# Altium schematic sheet top_level.SchDoc: TOP LEVEL
size A2; Organization: Altium Limited; Address1: L3, 12a Rodborough Rd; Address2: Frenchs Forest; Address3: NSW; Address4: Australia 2086; DocumentNumber: 1; Revision: 1
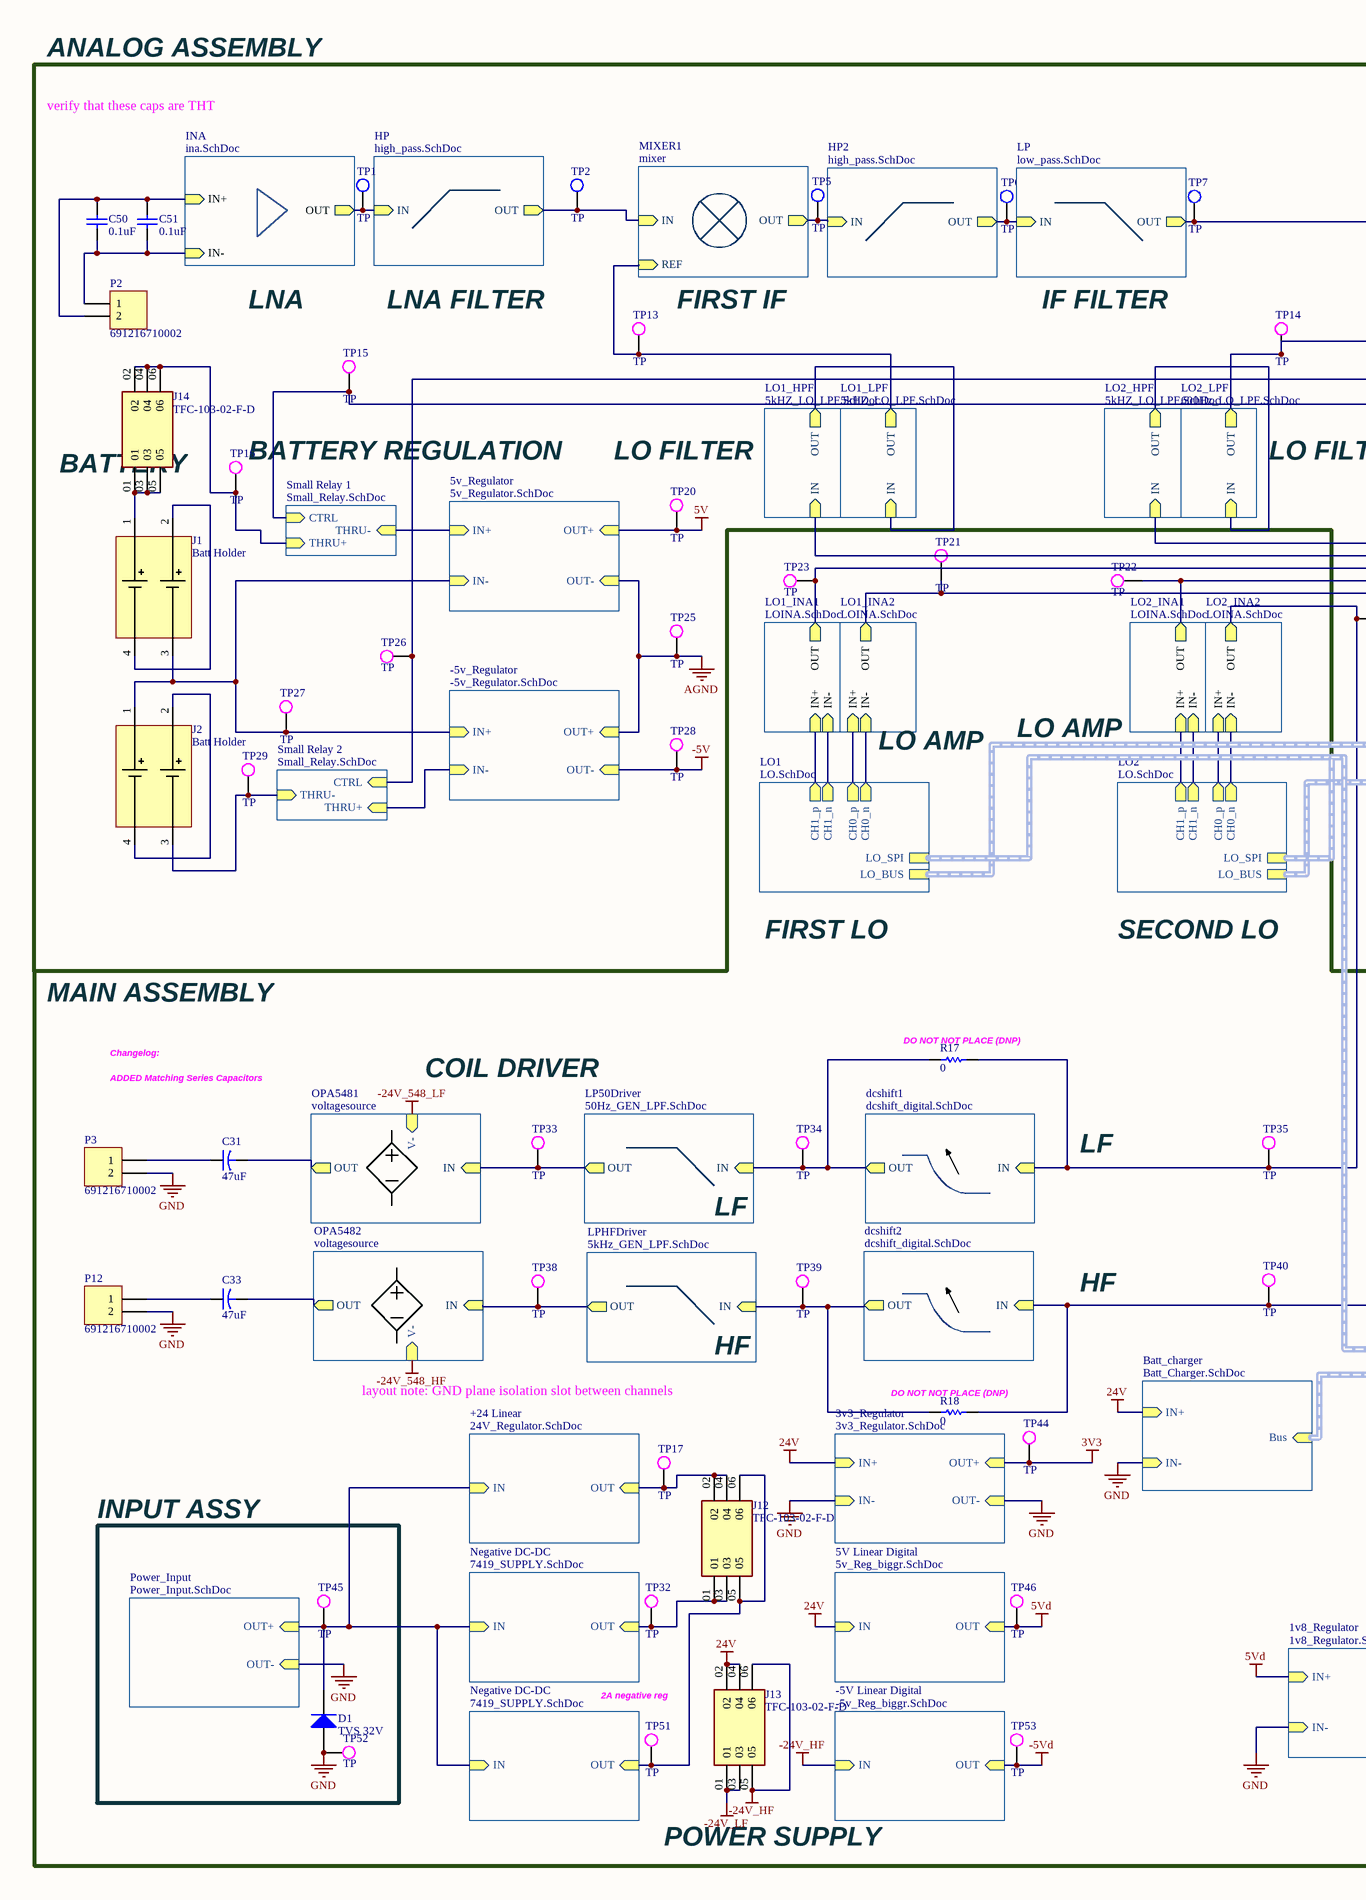
[diagram p0: top_level.SchDoc, left]
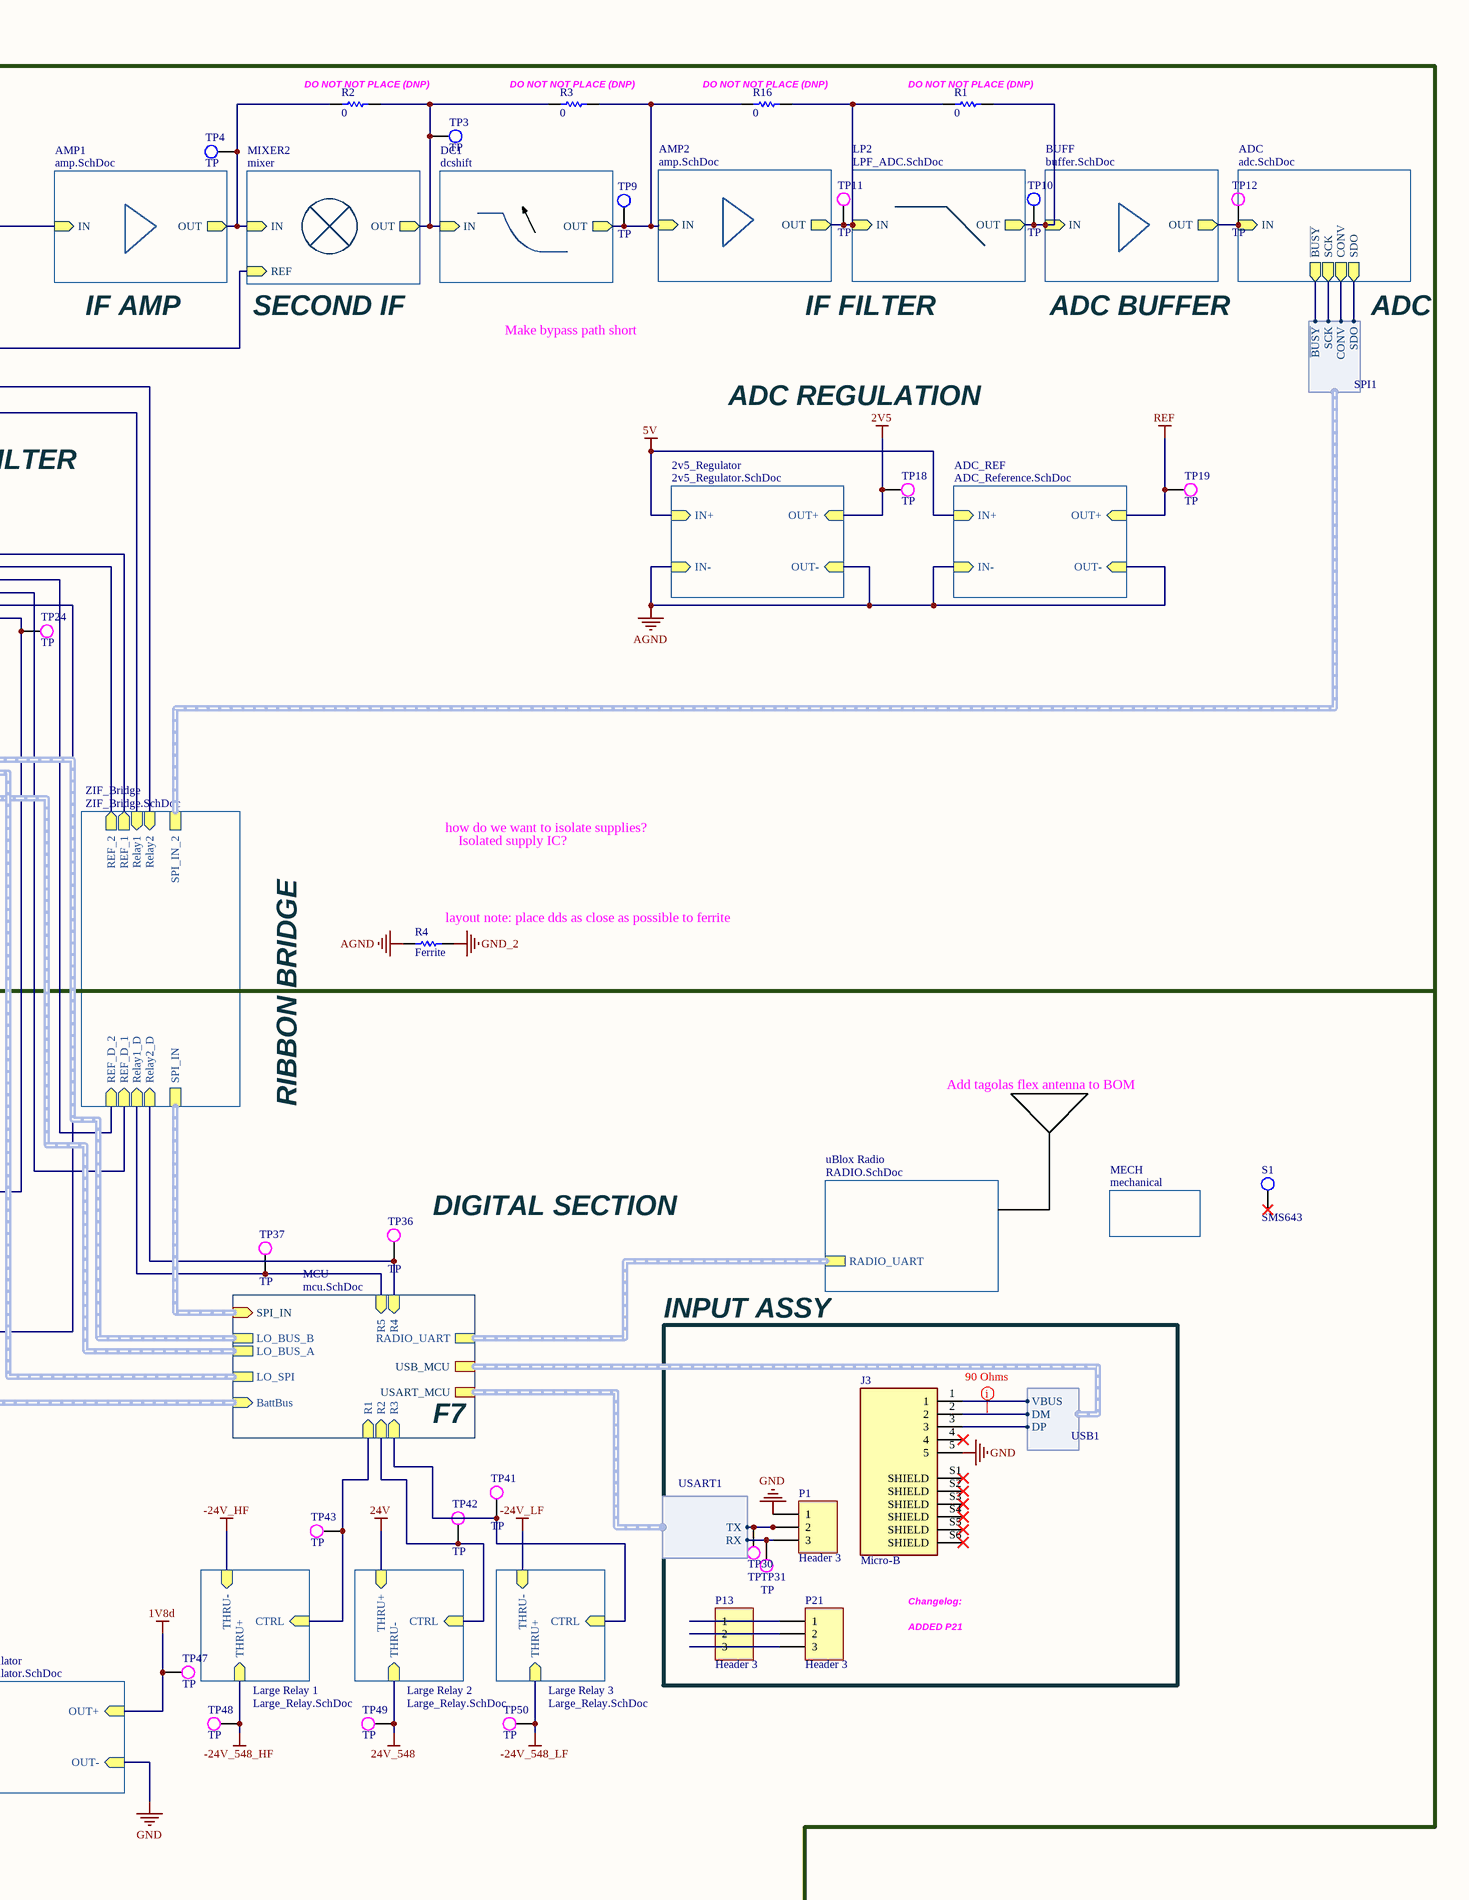
[diagram p1: top_level.SchDoc, right]

## Parts
C31  47uF  [R60xW]
C33  47uF  [10uF_THT_Ceramic]
C50  0.1uF  [STD_0805_C]
C51  0.1uF  [STD_0805_C]
D1  TVS 32V  [TVSDIODE-DO214AA]
J1  Batt Holder  [SMD_Batteryholder]
J2  Batt Holder  [SMD_Batteryholder]
J3  Micro-B  [10118194-0001LF]
J12  TFC-103-02-F-D  [SAMTEC_TFC-103-02-F-D]
J13  TFC-103-02-F-D  [SAMTEC_TFC-103-02-F-D]
J14  TFC-103-02-F-D  [SAMTEC_TFC-103-02-F-D]
P1  Header 3  [HDR1X3]
P2  691216710002  [HDR1X2]
P3  691216710002  [HDR1X2]
P12  691216710002  [HDR1X2]
P13  Header 3  [HDR1X3]
P21  Header 3  [HDR1X3]
R1  0  [0402_Res]
R2  0  [0402_Res]
R3  0  [0402_Res]
R4  Ferrite  [0402_Res]
R16  0  [0402_Res]
R17  0  [0402_Res]
R18  0  [0402_Res]
S1  SMS643  [SMS-463F]
TP1  TP  [Test_point]
TP2  TP  [Test_point]
TP3  TP  [Test_point]
TP4  TP  [Test_point]
TP5  TP  [Test_point]
TP6  TP  [Test_point]
TP7  TP  [Test_point]
TP9  TP  [Test_point]
TP10  TP  [Test_point]
TP11  TP  [Test_point]
TP12  TP  [Test_point]
TP13  TP  [Test_point]
TP14  TP  [Test_point]
TP15  TP  [Test_point]
TP16  TP  [Test_point]
TP17  TP  [Test_point]
TP18  TP  [Test_point]
TP19  TP  [Test_point]
TP20  TP  [Test_point]
TP21  TP  [Test_point]
TP22  TP  [Test_point]
TP23  TP  [Test_point]
TP24  TP  [Test_point]
TP25  TP  [Test_point]
TP26  TP  [Test_point]
TP27  TP  [Test_point]
TP28  TP  [Test_point]
TP29  TP  [Test_point]
TP30  TP  [Test_point]
TP31  TP  [Test_point]
TP32  TP  [Test_point]
TP33  TP  [Test_point]
TP34  TP  [Test_point]
TP35  TP  [Test_point]
TP36  TP  [Test_point]
TP37  TP  [Test_point]
TP38  TP  [Test_point]
TP39  TP  [Test_point]
TP40  TP  [Test_point]
TP41  TP  [Test_point]
TP42  TP  [Test_point]
TP43  TP  [Test_point]
TP44  TP  [Test_point]
TP45  TP  [Test_point]
TP46  TP  [Test_point]
TP47  TP  [Test_point]
TP48  TP  [Test_point]
TP49  TP  [Test_point]
TP50  TP  [Test_point]
TP51  TP  [Test_point]
TP52  TP  [Test_point]
TP53  TP  [Test_point]

## Blocks framed on the sheet
INPUT ASSY: J3 P1 P13 P21 TP30 TP31
INPUT ASSY: D1 TP45 TP52

## Sub-sheets
1v8_Regulator = 1v8_Regulator.SchDoc: IN+ (in), IN- (in), OUT+ (in), OUT- (in)
2v5_Regulator = 2v5_Regulator.SchDoc: IN+ (in), IN- (in), OUT+ (in), OUT- (in)
3v3_Regulator = 3v3_Regulator.SchDoc: IN+ (in), IN- (in), OUT+ (in), OUT- (in)
5V Linear Digital = 5v_Reg_biggr.SchDoc: IN (in), OUT (in)
5v_Regulator = 5v_Regulator.SchDoc: IN+ (in), IN- (in), OUT+ (in), OUT- (in)
+24 Linear = 24V_Regulator.SchDoc: IN (in), OUT (in)
-5V Linear Digital = -5v_Reg_biggr.SchDoc: IN (in), OUT (in)
-5v_Regulator = -5v_Regulator.SchDoc: IN+ (in), IN- (in), OUT+ (in), OUT- (in)
ADC = adc.SchDoc: IN (in), SDO (out), SCK (out), ~{BUSY} (out), CONV (out)
ADC_REF = ADC_Reference.SchDoc: IN+ (in), IN- (in), OUT+ (in), OUT- (in)
AMP1 = amp.SchDoc: IN (in), OUT (out)
AMP2 = amp.SchDoc: IN (in), OUT (out)
Batt_charger = Batt_Charger.SchDoc: IN+ (in), IN- (in), Bus (in, harness BattBus)
BUFF = buffer.SchDoc: IN (in), OUT (out)
DC1 = dcshift: IN (in), OUT (out)
dcshift1 = dcshift_digital.SchDoc: IN (in), OUT (out)
dcshift2 = dcshift_digital.SchDoc: IN (in), OUT (out)
HP = high_pass.SchDoc: IN (in), OUT (out)
HP2 = high_pass.SchDoc: IN (in), OUT (out)
INA = ina.SchDoc: IN+ (in), IN- (in), OUT (out)
Large Relay 1 = Large_Relay.SchDoc: CTRL (in), THRU+ (in), THRU- (in)
Large Relay 2 = Large_Relay.SchDoc: CTRL (in), THRU+ (in), THRU- (in)
Large Relay 3 = Large_Relay.SchDoc: CTRL (in), THRU+ (in), THRU- (in)
LO1 = LO.SchDoc: CH1_p (out), CH1_n (out), CH0_p (out), CH0_n (out), LO_BUS (harness LO_BUS), LO_SPI (harness LO_SPI)
LO1_HPF = 5kHZ_LO_LPF.SchDoc: IN (in), OUT (out)
LO1_INA1 = LOINA.SchDoc: IN+ (in), IN- (in), OUT (out)
LO1_INA2 = LOINA.SchDoc: IN+ (in), IN- (in), OUT (out)
LO1_LPF = 5kHZ_LO_LPF.SchDoc: IN (in), OUT (out)
LO2 = LO.SchDoc: CH1_p (out), CH1_n (out), CH0_n (out), CH0_p (out), LO_BUS (harness LO_BUS), LO_SPI (harness LO_SPI)
LO2_HPF = 5kHZ_LO_LPF.SchDoc: IN (in), OUT (out)
LO2_INA1 = LOINA.SchDoc: IN+ (in), IN- (in), OUT (out)
LO2_INA2 = LOINA.SchDoc: IN+ (in), IN- (in), OUT (out)
LO2_LPF = 600Hz_LO_LPF.SchDoc: IN (in), OUT (out)
LP = low_pass.SchDoc: IN (in), OUT (out)
LP2 = LPF_ADC.SchDoc: IN (in), OUT (out)
LP50Driver = 50Hz_GEN_LPF.SchDoc: IN (in), OUT (out)
LPHFDriver = 5kHz_GEN_LPF.SchDoc: IN (in), OUT (out)
MCU = mcu.SchDoc: USART_MCU (harness USART1), SPI_IN (in, harness SPI1), USB_MCU (harness USB1), LO_BUS_B (harness LO_BUS), LO_BUS_A (harness LO_BUS), RADIO_UART (harness RADIO_UART), LO_SPI (harness LO_SPI), BattBus (in, harness BattBus), R4 (in), R3 (in), R1 (in), R2 (in), R5 (in)
MECH = mechanical: no entries
MIXER1 = mixer: IN (in), OUT (out), REF (in)
MIXER2 = mixer: IN (in), OUT (out), REF (in)
Negative DC-DC = 7419_SUPPLY.SchDoc: IN (in), OUT (in)
Negative DC-DC = 7419_SUPPLY.SchDoc: IN (in), OUT (in)
OPA5481 = voltagesource: IN (in), OUT (out), V- (in)
OPA5482 = voltagesource: IN (in), OUT (out), V- (in)
Power_Input = Power_Input.SchDoc: OUT+ (in), OUT- (in)
Small Relay 1 = Small_Relay.SchDoc: CTRL (in), THRU+ (in), THRU- (in)
Small Relay 2 = Small_Relay.SchDoc: CTRL (in), THRU+ (in), THRU- (in)
uBlox Radio = RADIO.SchDoc: RADIO_UART (harness RADIO_UART)
ZIF_Bridge = ZIF_Bridge.SchDoc: SPI_IN_2 (harness SPI1), SPI_IN (harness SPI1), Relay1 (in), Relay2 (in), Relay1_D (in), Relay2_D (in), REF_D_1 (in), REF_2 (out), REF_D_2 (in), REF_1 (out)

## Harnesses
SPI1: ~{BUSY}, SCK, CONV, SDO
USB1: VBUS, DM, DP
USART1: TX, RX

## Nets
1V8d: TP47.1 ; sheet 1v8_Regulator/OUT+
2V5: TP18.1 ; sheet 2v5_Regulator/OUT+
3V3: TP44.1 ; sheet 3v3_Regulator/OUT+
5V: TP20.1 ; sheet ADC_REF/IN+, sheet 2v5_Regulator/IN+, sheet 5v_Regulator/OUT+
5Vd: TP46.1 ; sheet 5V Linear Digital/OUT, sheet 1v8_Regulator/IN+
24V: J13.02 J13.04 ; sheet 3v3_Regulator/IN+, sheet Batt_charger/IN+, sheet Large Relay 2/THRU+, sheet 5V Linear Digital/IN
24V_548: TP49.1 ; sheet Large Relay 2/THRU-
-5V: TP28.1 ; sheet -5v_Regulator/OUT-
-5Vd: TP53.1 ; sheet -5V Linear Digital/OUT
-24V_548_HF: TP48.1 ; sheet OPA5482/V-, sheet Large Relay 1/THRU+
-24V_548_LF: TP50.1 ; sheet OPA5481/V-, sheet Large Relay 3/THRU+
-24V_HF: J13.05 J13.06 ; sheet Large Relay 1/THRU-, sheet -5V Linear Digital/IN
-24V_LF: J13.01 J13.03 ; sheet Large Relay 3/THRU-
AGND: R4.1 TP25.1 ; sheet ADC_REF/IN-, sheet ADC_REF/OUT-, sheet 2v5_Regulator/IN-, sheet 2v5_Regulator/OUT-, sheet 5v_Regulator/OUT-, sheet -5v_Regulator/OUT+
GND: D1.1(A) J3.5 P1.1 P3.2 P12.2 TP52.1 ; sheet 3v3_Regulator/IN-, sheet 3v3_Regulator/OUT-, sheet Power_Input/OUT-, sheet Batt_charger/IN-, sheet 1v8_Regulator/IN-, sheet 1v8_Regulator/OUT-
GND_2: R4.2
REF: TP19.1 ; sheet ADC_REF/OUT+
NetC31_1: C31.1 P3.1
NetC31_2: C31.2 ; sheet OPA5481/OUT
NetC33_1: C33.1 P12.1
NetC33_2: C33.2 ; sheet OPA5482/OUT
NetC50_1: C50.1 C51.1 P2.1 ; sheet INA/IN-
NetC50_2: C50.2 C51.2 P2.2 ; sheet INA/IN+
NetD1_2: D1.2(K) TP45.1 ; sheet Power_Input/OUT+, sheet Negative DC-DC/IN, sheet Negative DC-DC/IN, sheet +24 Linear/IN
NetJ1_1: J1.1 J14.01 J14.03 J14.05
NetJ1_2: J1.2 J1.4
NetJ1_3: J1.3 J2.1 TP27.1 ; sheet 5v_Regulator/IN-, sheet -5v_Regulator/IN+
NetJ2_2: J2.2 J2.4
NetJ2_3: J2.3 TP29.1 ; sheet Small Relay 2/THRU-
NetJ3_1: J3.1 ; sheet MCU/USB_MCU.VBUS
NetJ3_2: J3.2 ; sheet MCU/USB_MCU.DM
NetJ3_3: J3.3 ; sheet MCU/USB_MCU.DP
NetJ12_01: J12.01 J12.03 TP32.1 ; sheet Negative DC-DC/OUT
NetJ12_02: J12.02 J12.04 TP17.1 ; sheet +24 Linear/OUT
NetJ12_05: J12.05 J12.06 TP51.1 ; sheet Negative DC-DC/OUT
NetJ14_02: J14.02 J14.04 J14.06 TP16.1 ; sheet Small Relay 1/THRU+
NetP1_2: P1.2 TP30.1 ; sheet MCU/USART_MCU.TX
NetP1_3: P1.3 TP31.1 ; sheet MCU/USART_MCU.RX
NetP13_1: P13.1 P21.1
NetP13_2: P13.2 P21.2
NetP13_3: P13.3 P21.3
NetR1_1: R1.1 R16.2 TP11.1 ; sheet LP2/IN, sheet AMP2/OUT
NetR1_2: R1.2 TP10.1 ; sheet BUFF/IN, sheet LP2/OUT
NetR2_1: R2.1 TP4.1 ; sheet AMP1/OUT, sheet MIXER2/IN
NetR2_2: R2.2 R3.1 TP3.1 ; sheet DC1/IN, sheet MIXER2/OUT
NetR3_2: R3.2 R16.1 TP9.1 ; sheet DC1/OUT, sheet AMP2/IN
NetR17_1: R17.1 TP34.1 ; sheet dcshift1/OUT, sheet LP50Driver/IN
NetR17_2: R17.2 TP24.1 TP35.1 ; sheet dcshift1/IN, sheet LO2_INA2/OUT
NetR18_1: R18.1 TP39.1 ; sheet dcshift2/OUT, sheet LPHFDriver/IN
NetR18_2: R18.2 TP21.1 TP40.1 ; sheet dcshift2/IN, sheet LO1_INA2/OUT
NetTP1_1: TP1.1 ; sheet INA/OUT, sheet HP/IN
NetTP2_1: TP2.1 ; sheet HP/OUT, sheet MIXER1/IN
NetTP5_1: TP5.1 ; sheet MIXER1/OUT, sheet HP2/IN
NetTP6_1: TP6.1 ; sheet HP2/OUT, sheet LP/IN
NetTP7_1: TP7.1 ; sheet AMP1/IN, sheet LP/OUT
NetTP12_1: TP12.1 ; sheet BUFF/OUT, sheet ADC/IN
NetTP13_1: TP13.1 ; sheet MIXER1/REF, sheet LO1_LPF/OUT
NetTP14_1: TP14.1 ; sheet MIXER2/REF, sheet LO2_LPF/OUT
NetTP15_1: TP15.1 ; sheet Small Relay 1/CTRL, sheet ZIF_Bridge/Relay1
NetTP22_1: TP22.1 ; sheet LO2_INA1/OUT, sheet ZIF_Bridge/REF_D_1
NetTP23_1: TP23.1 ; sheet LO1_INA1/OUT, sheet ZIF_Bridge/REF_D_2
NetTP26_1: TP26.1 ; sheet Small Relay 2/CTRL, sheet ZIF_Bridge/Relay2
NetTP33_1: TP33.1 ; sheet OPA5481/IN, sheet LP50Driver/OUT
NetTP36_1: TP36.1 ; sheet MCU/R4, sheet ZIF_Bridge/Relay2_D
NetTP37_1: TP37.1 ; sheet MCU/R5, sheet ZIF_Bridge/Relay1_D
NetTP38_1: TP38.1 ; sheet OPA5482/IN, sheet LPHFDriver/OUT
NetTP41_1: TP41.1 ; sheet MCU/R3, sheet Large Relay 3/CTRL
NetTP42_1: TP42.1 ; sheet MCU/R2, sheet Large Relay 2/CTRL
NetTP43_1: TP43.1 ; sheet MCU/R1, sheet Large Relay 1/CTRL
(unnamed): sheet ADC/SDO, sheet ZIF_Bridge/SPI_IN_2.SDO
(unnamed): sheet ADC/SCK, sheet ZIF_Bridge/SPI_IN_2.SCK
(unnamed): sheet ADC/~{BUSY}, sheet ZIF_Bridge/SPI_IN_2.~{BUSY}
(unnamed): sheet ADC/CONV, sheet ZIF_Bridge/SPI_IN_2.CONV
(unnamed): sheet LO1/CH1_p, sheet LO1_INA1/IN+
(unnamed): sheet LO1/CH1_n, sheet LO1_INA1/IN-
(unnamed): sheet LO1/CH0_p, sheet LO1_INA2/IN+
(unnamed): sheet LO1/CH0_n, sheet LO1_INA2/IN-
(unnamed): sheet LO2/CH1_p, sheet LO2_INA1/IN+
(unnamed): sheet LO2/CH1_n, sheet LO2_INA1/IN-
(unnamed): sheet LO2/CH0_n, sheet LO2_INA2/IN-
(unnamed): sheet LO2/CH0_p, sheet LO2_INA2/IN+
(unnamed): sheet 5v_Regulator/IN+, sheet Small Relay 1/THRU-
(unnamed): sheet -5v_Regulator/IN-, sheet Small Relay 2/THRU+
(unnamed): sheet ZIF_Bridge/REF_2, sheet LO1_HPF/IN
(unnamed): sheet ZIF_Bridge/REF_1, sheet LO2_HPF/IN
(unnamed): sheet LO1_LPF/IN, sheet LO1_HPF/OUT
(unnamed): sheet LO2_LPF/IN, sheet LO2_HPF/OUT

Not connected (* = marked no-connect by the designer): J3 4* S1(SHIELD)* S2(SHIELD)* S3(SHIELD)* S4(SHIELD)* S5(SHIELD)* S6(SHIELD)*; S1 1*

## Buses and harness runs
harness sheet Batt_charger/Bus = sheet MCU/BattBus
harness sheet LO1/LO_BUS = sheet MCU/LO_BUS_B
harness sheet LO1/LO_SPI = sheet LO2/LO_SPI = sheet MCU/LO_SPI
harness sheet LO2/LO_BUS = sheet MCU/LO_BUS_A
harness sheet MCU/RADIO_UART = sheet uBlox Radio/RADIO_UART
harness sheet MCU/SPI_IN = sheet ZIF_Bridge/SPI_IN

## Layout directives
mark named 90 Ohms: (no net found under the mark)

## Notes on the sheet
- ANALOG ASSEMBLY
- verify that these caps are THT
- (near R2) DO NOT NOT PLACE (DNP)
- (near R3) DO NOT NOT PLACE (DNP)
- (near R16) DO NOT NOT PLACE (DNP)
- (near R1) DO NOT NOT PLACE (DNP)
- LNA
- LNA FILTER
- (near TP13) FIRST IF
- IF FILTER
- IF AMP
- SECOND IF
- Make bypass path short
- ADC BUFFER
- ADC
- ADC REGULATION
- (near J14) BATTERY
- (near TP16) BATTERY REGULATION
- (near TP20) LO FILTER
- LO FILTER
- LO AMP
- how do we want to isolate supplies?
- Isolated supply IC?
- (near R4) layout note: place dds as close as possible to ferrite
- FIRST LO
- SECOND LO
- MAIN ASSEMBLY
- Changelog:
- (near R17) DO NOT NOT PLACE (DNP)
- ADDED Matching Series Capacitors
- COIL DRIVER
- RIBBON BRIDGE
- Add tagolas flex antenna to BOM
- LF
- (near TP36) DIGITAL SECTION
- HF
- layout note: GND plane isolation slot between channels
- (near R18) DO NOT NOT PLACE (DNP)
- F7
- ADDED P21
- 2A negative reg
- POWER SUPPLY
- Title
- Date:
- RE:
- Arturo di Girolamo
- Size:
- A2
- A

## Library data of the parts
C31 C33 = UCY2C470MPD: Capacitor, 47uF NICHICON; MFGPN: UCY2C470MPD
C50 C51 = CL21B104KACNNNC: Capacitor, 0.1uF, 0805; Value: .01uf; MFGPN: CL21B104KACNNNC
D1 = Diode: Default Diode; Published: 8-Jun-2000; LatestRevisionDate: 17-Jul-2002; LatestRevisionNote: Re-released for DXP Platform.; PackageVersion: Sep-1996; PackageReference: SMC; Publisher: Altium Limited; PackageDescription: DO-214-AB/SMC; 2 C-Bend Leads; Body 7.9 x 5.9 mm, inc. leads (LxW); Code_JEDEC: DO-214-AB
J1 J2 = 1048_Keystone_18650
J3 = 10118194-0001LF: USB - micro B USB 2.0 Receptacle Connector 5 Position Surface Mount, Right Angle; Through Hole; MFGPN: 10118194-0001LF
J12-J14 = TFC-103-02-F-D: MF: Samtec; Value: *; Availability: Unavailable; MP: TFC-103-02-F-D; Price: None; Package: None; ASYPN: TFC-103-02-F-D; ASYMFG: SAMTEC
P1 P13 P21 = Header 3: Header, 3-Pin; LatestRevisionDate: 17-Jul-2002; LatestRevisionNote: Re-released for DXP Platform.; Publisher: Altium Limited
P2 P3 P12 = Header 2: Header, 2-Pin; LatestRevisionDate: 17-Jul-2002; LatestRevisionNote: Re-released for DXP Platform.; Publisher: Altium Limited
R1-R3 R16-R18 = RMCF0805ZT0R00: 0 ohm jumper; Value: 0; ASYPN: RMCF0805ZT0R00
R4 = BMB2A0600AN4: Ferrite 0805; MFGPN: BMB2A0600AN4
TP1-TP7 TP9 TP10 = TP: Test Point
TP11-TP53 = TP_PCB: Test Point